# EasyEDA schematic HW1_1_a.json
TITLE: Sheet_1; REV: 1.0; Date: 2020-11-04; Sheet: 1/1; Drawn By: gokbeykeskin_4066; Company: Your Company
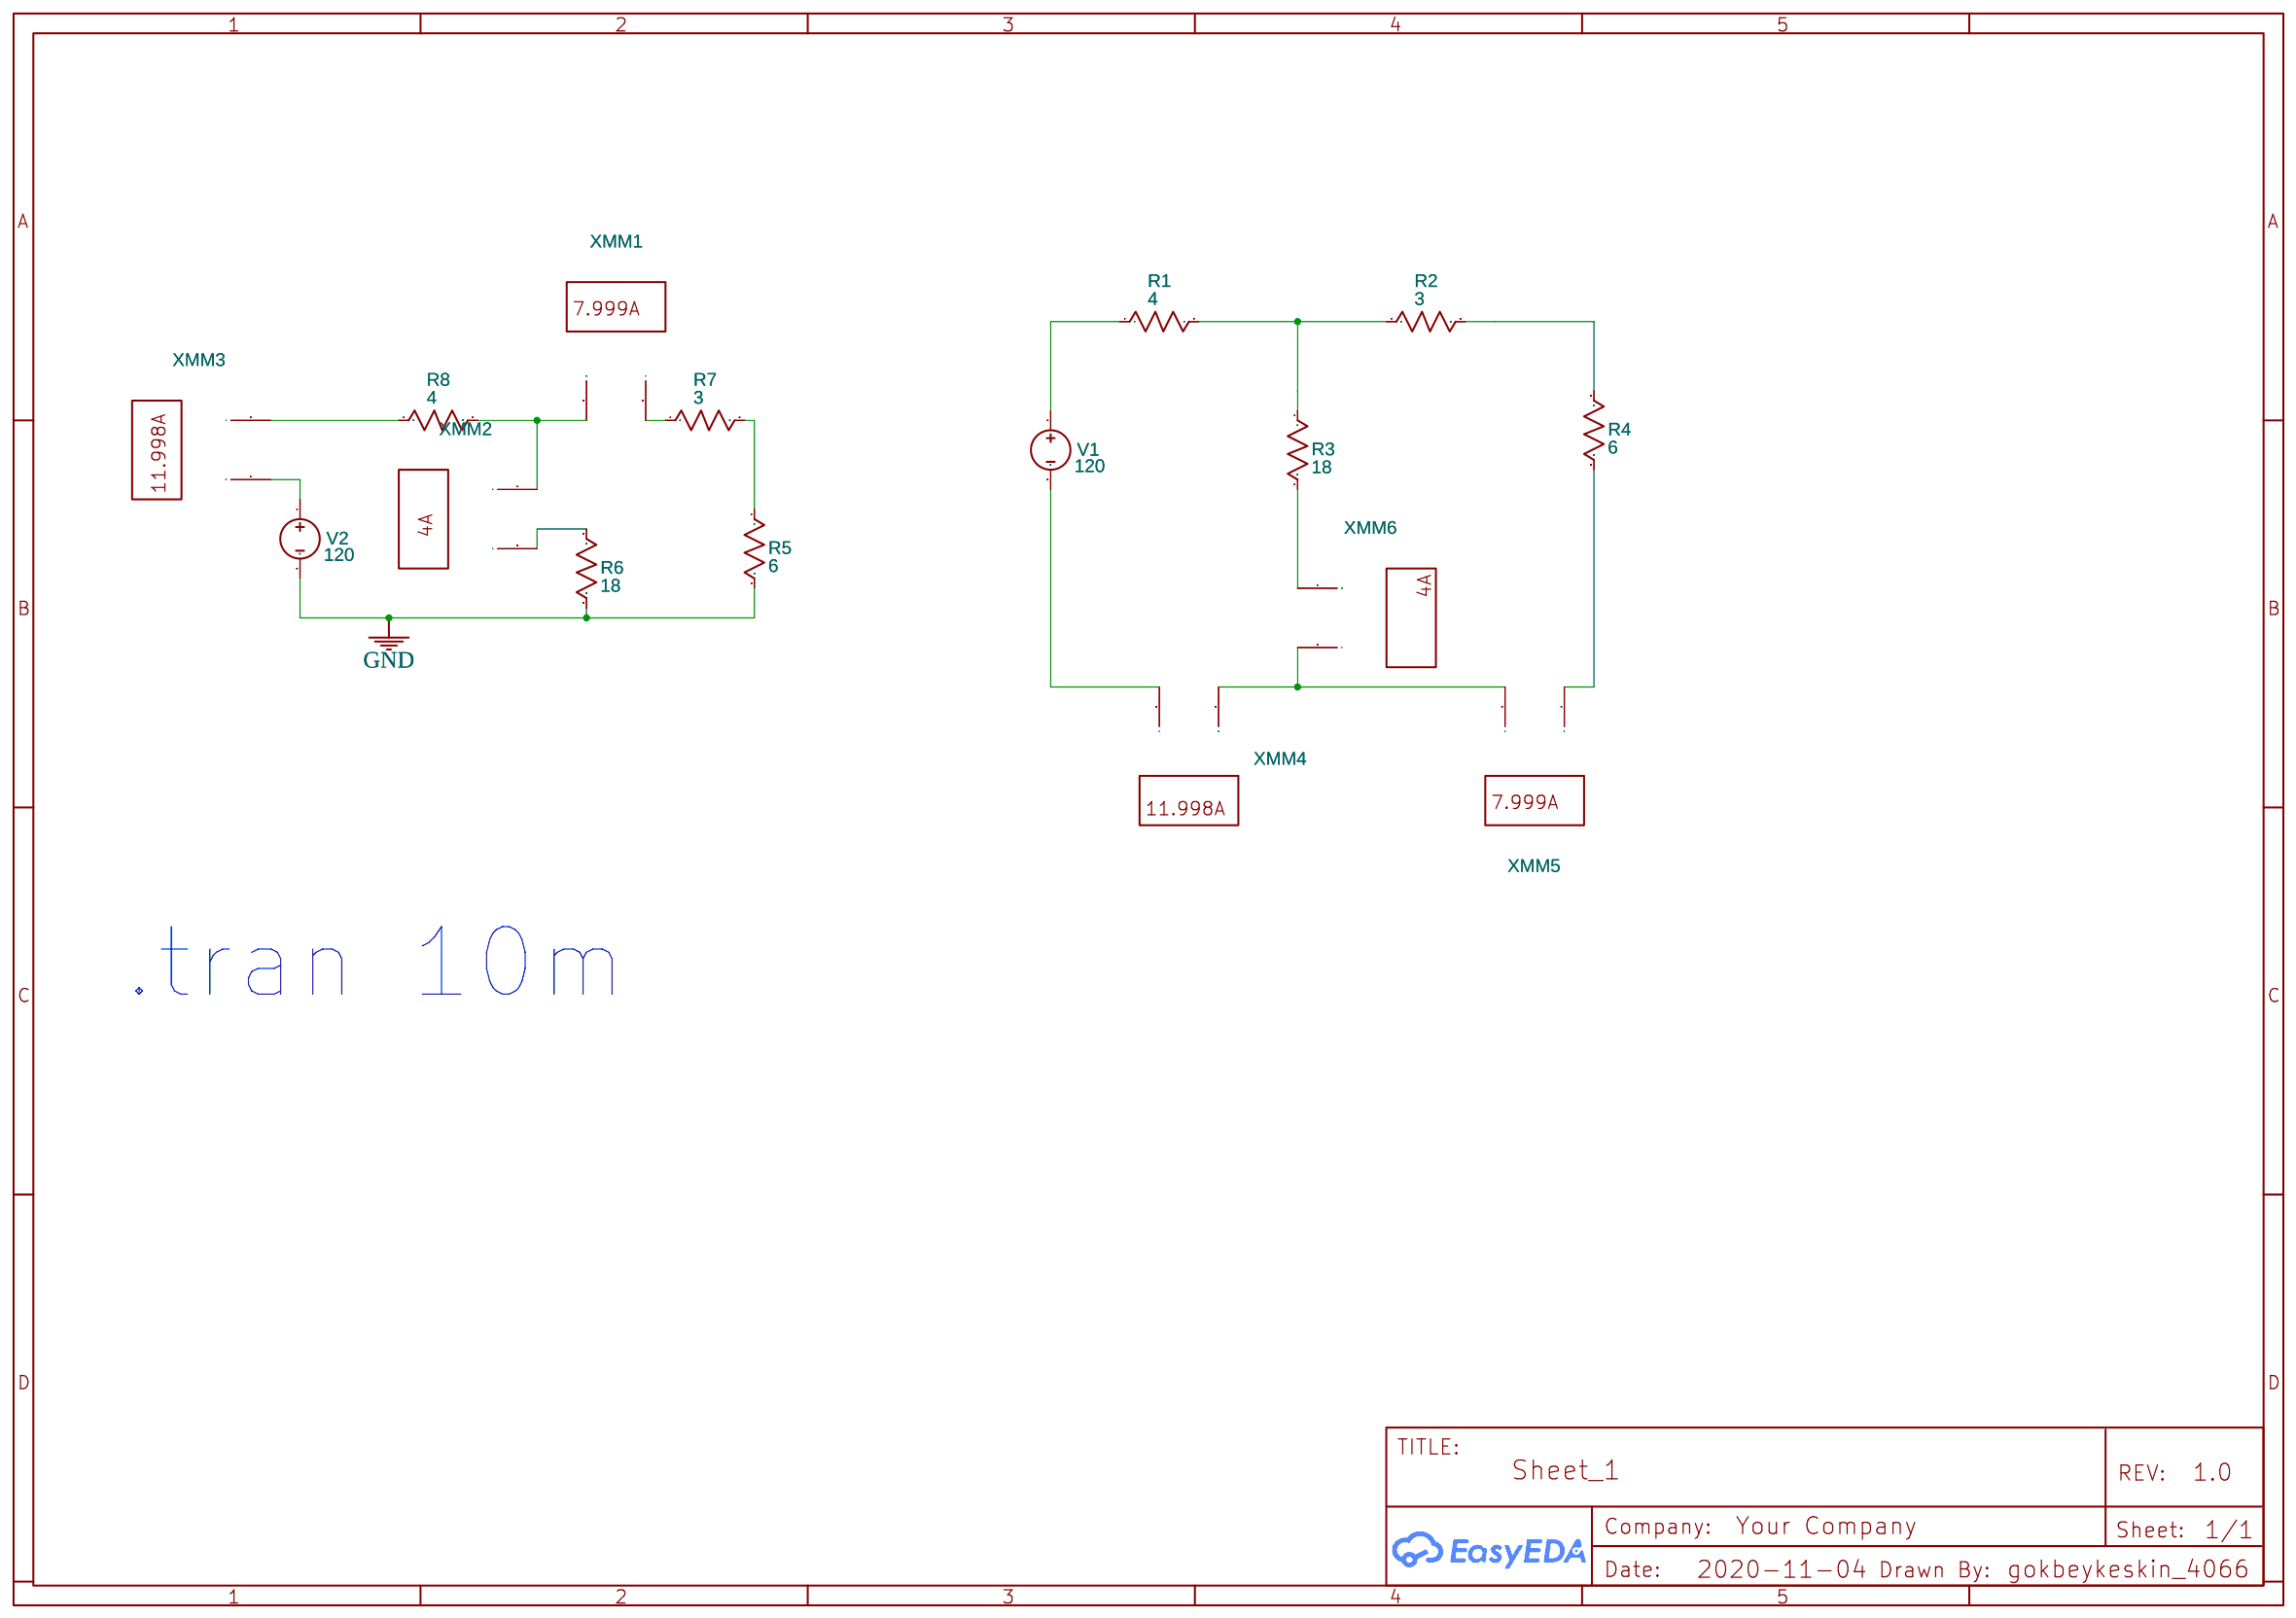
[diagram p0: schematic sheet]

## Parts
R1  4  [AXIAL-0.3]
R2  3  [AXIAL-0.3]
R3  18  [AXIAL-0.3]
R4  6  [AXIAL-0.3]
R5  6  [AXIAL-0.3]
R6  18  [AXIAL-0.3]
R7  3  [AXIAL-0.3]
R8  4  [AXIAL-0.3]
V1  120  [HDR1X2]
V2  120  [HDR1X2]
XMM1  Multimeter
XMM2  Multimeter
XMM3  Multimeter
XMM4  Multimeter
XMM5  Multimeter
XMM6  Multimeter

## Library data of the parts
R1-R8 = Resistor_US: Resistance: 1k; Contributor: EasyEDA; Supplier: YUJING
V1 V2 = VDC: Contributor: EasyEDA; sim: true
XMM1-XMM6 = MULTIMETER: Supplier: LCSC; Multimeter Type: Amper; Power Type: AC; Voltmeter resistance: 10μ; Ammeter resistance: 1G; NameDisplay: 0; Contributor: EasyEDA; sim: true

## Nets
GND: R5.2 R6.2 V2.2
Net-(R1-1): R1.1 V1.1
Net-(R1-2): R1.2 R2.1 R3.1
Net-(R2-2): R2.2 R4.1
Net-(R3-2): R3.2 XMM6.1(+)
Net-(R4-2): R4.2 XMM5.1(+)
Net-(R5-1): R5.1 R7.2
Net-(R6-1): R6.1 XMM2.2(I)
Net-(R7-1): R7.1 XMM1.2(I)
Net-(R8-1): R8.1 XMM3.2(I)
Net-(R8-2): R8.2 XMM1.1(+) XMM2.1(+)
Net-(V1-2): V1.2 XMM4.2(I)
Net-(V2-1): V2.1 XMM3.1(+)
Net-(XMM4-1): XMM4.1(+) XMM5.2(I) XMM6.2(I)

## Notes on the sheet
- .tran 10m
